# Altium schematic sheet SCH_Persion_Counter.SchDoc
size A3; SheetNumber: 1; SheetTotal: 1
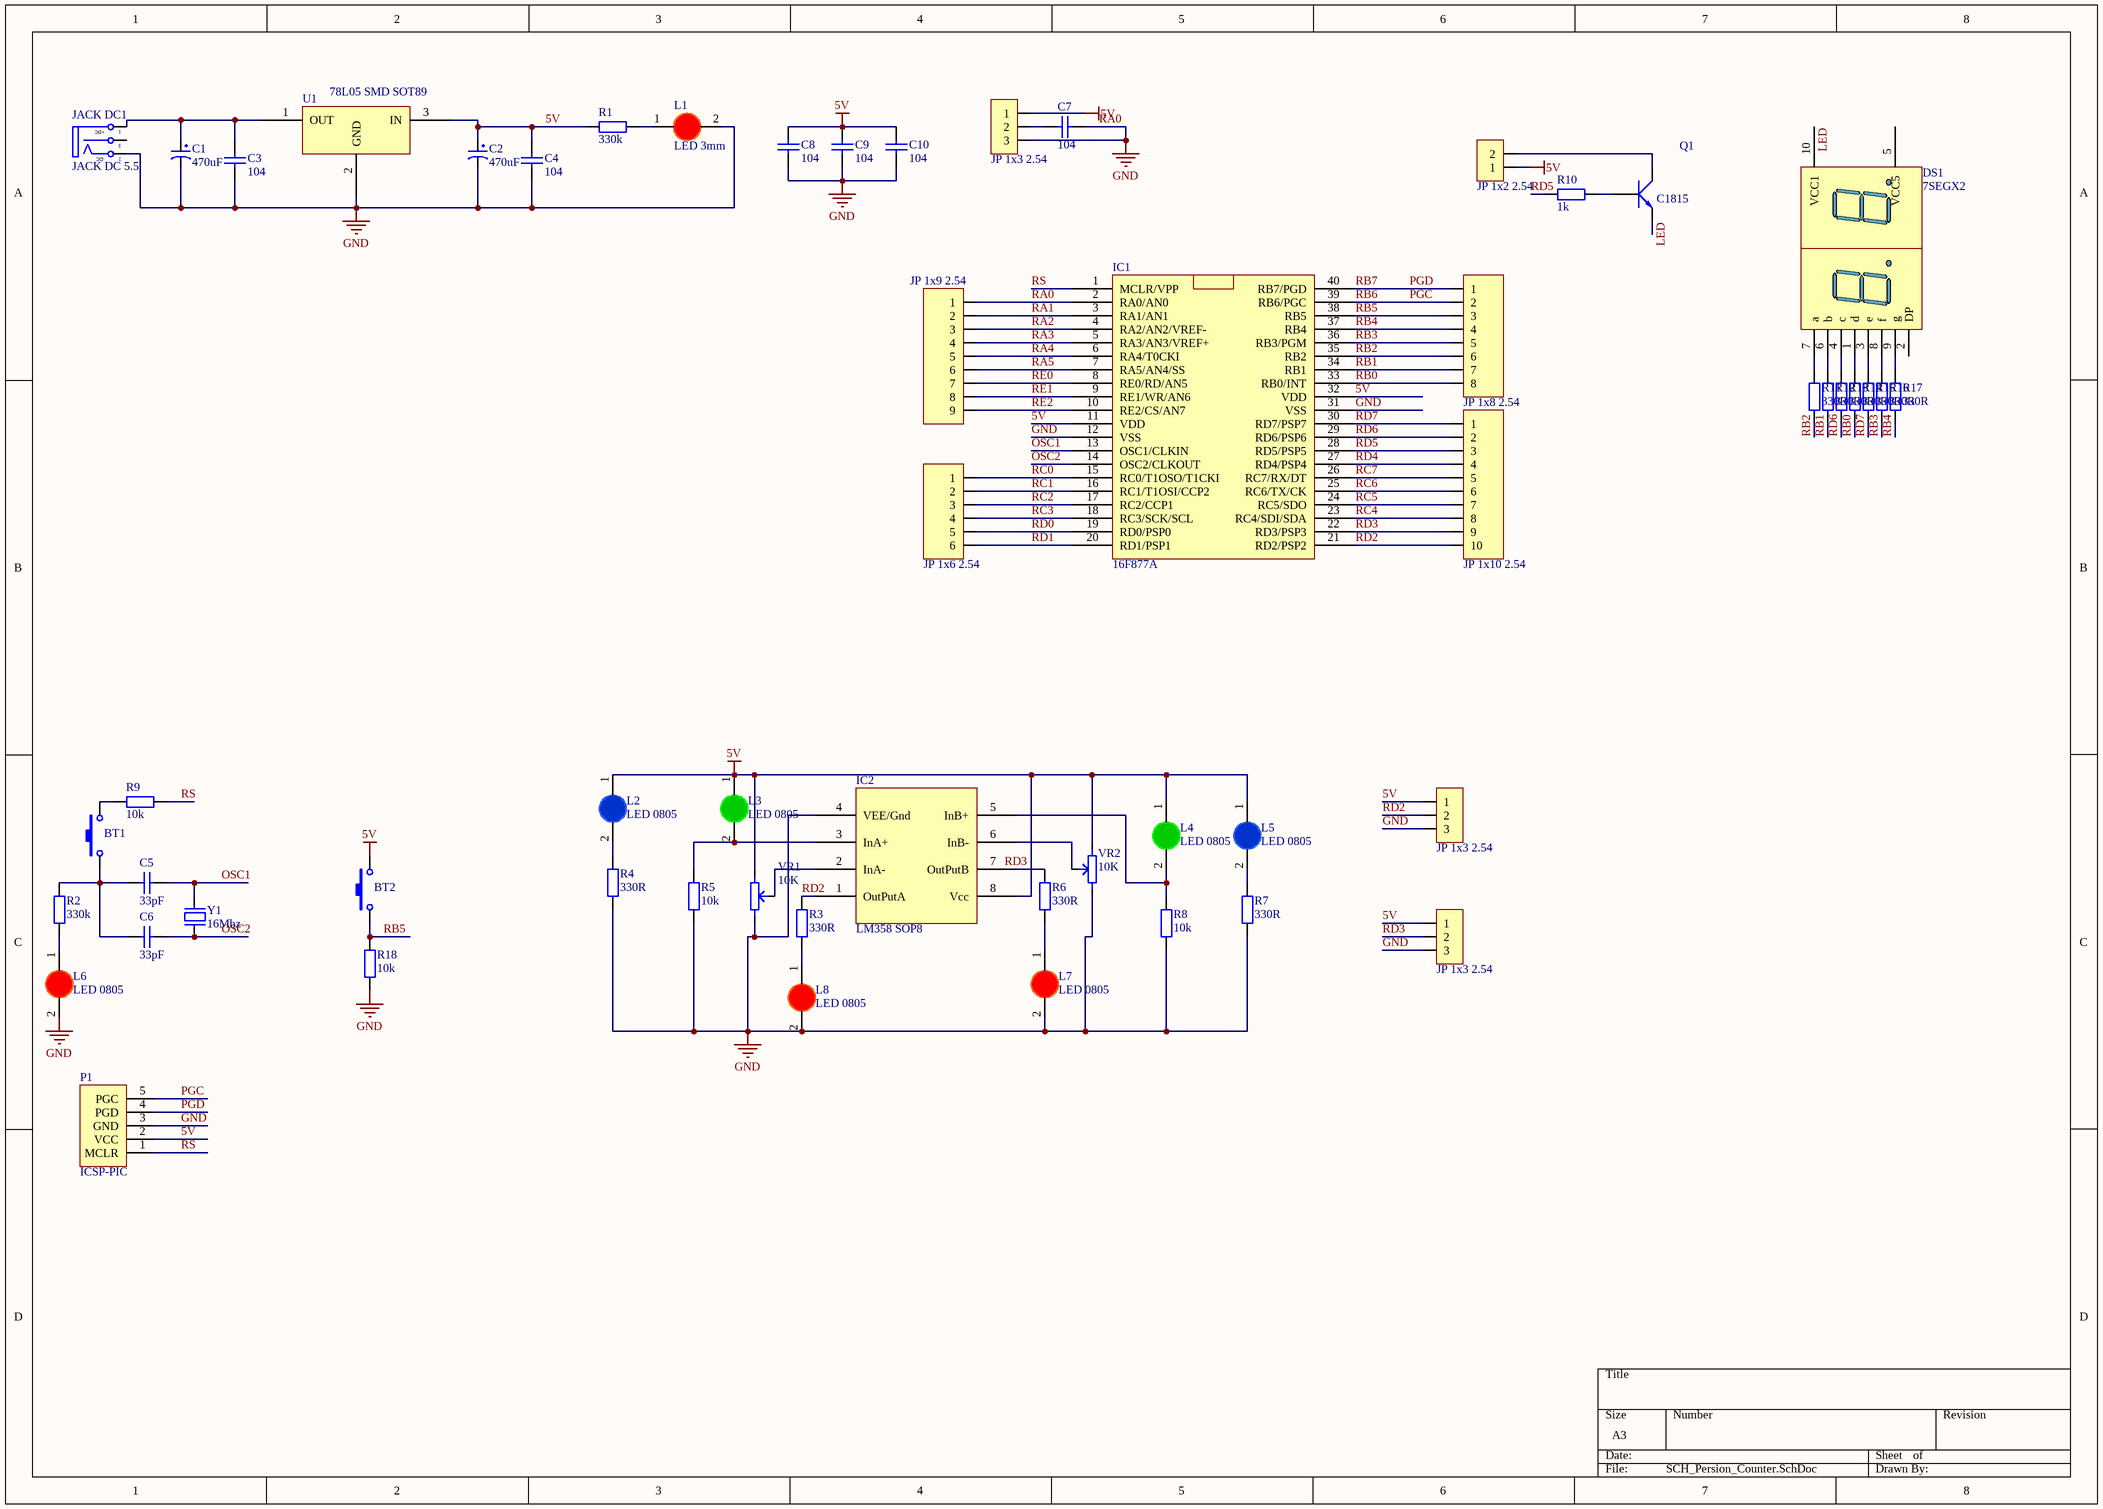
[diagram p0: SCH_Persion_Counter.SchDoc]

## Parts
BT1  Nut Nhan 2 Chan SMD 3x6x2.5  [Nut Nhan 2 Chan SMD 3x6x2.5]  (value not drawn)
BT2  Nut Nhan 2 Chan SMD 3x6x2.5  [Nut Nhan 2 Chan SMD 3x6x2.5]  (value not drawn)
C1  470uF  [tu hoa 8mm]
C2  470uF  [tu hoa 8mm]
C3  104  [tu 0805]
C4  104  [tu 0805]
C5  33pF  [tu 0805]
C6  33pF  [tu 0805]
C7  104  [tu 0805]
C8  104  [tu 0805]
C9  104  [tu 0805]
C10  104  [tu 0805]
DS1  7SEGX2  [LED7SEGX2]
IC1  16F877A  [DIP40/W0.6]
IC2  LM358 SOP8  [SOP 8]
JACK_DC1  JACK DC 5.5  [JACK DC 5.5]
JP1  JP 1x3 2.54  [JP 1x3 DT]
JP2  JP 1x8 2.54  [JP 1x8 DT]
JP3  JP 1x9 2.54  [JP 1x9 DT]
JP4  JP 1x10 2.54  [JP 1x10 DT]
JP5  JP 1x6 2.54  [JP 1x6 DT]
JP6  JP 1x3 2.54  [JP 1x3 DT]
JP7  JP 1x3 2.54  [JP 1x3 DT]
JP8  JP 1x2 2.54  [JP 1x2 DT]
L1  LED 3mm  [LED-3MM-RED]
L2  LED 0805  [LED-0805-Blue]
L3  LED 0805  [LED-0805-Green]
L4  LED 0805  [LED-0805-Green]
L5  LED 0805  [LED-0805-Blue]
L6  LED 0805  [LED-0805-Red]
L7  LED 0805  [LED-0805-Red]
L8  LED 0805  [LED-0805-Red]
P1  ICSP-PIC  [HDR1X5]
Q1  C1815  [TO92]
R1  330k  [tro vach 1/4w]
R2  330k  [tro vach 1/4w]
R3  330R  [Tro SMD 0805]
R4  330R  [Tro SMD 0805]
R5  10k  [tro vach 1/4w]
R6  330R  [Tro SMD 0805]
R7  330R  [Tro SMD 0805]
R8  10k  [tro vach 1/4w]
R9  10k  [tro vach 1/4w]
R10  1k  [tro smd 0805]
R11  330R  [Tro SMD 0805]
R12  330R  [Tro SMD 0805]
R13  330R  [Tro SMD 0805]
R14  330R  [Tro SMD 0805]
R15  330R  [Tro SMD 0805]
R16  330R  [Tro SMD 0805]
R17  330R  [Tro SMD 0805]
R18  10k  [tro vach 1/4w]
U1  78L05 SMD SOT89  [SOT89]
VR1  10K  [Bien Tro Tam Giac Dung]
VR2  10K  [Bien Tro Tam Giac Dung]
Y1  16Mhz  [Thach Anh 2 chan SMD]

## Nets
5V: BT2.2 C2.1 C4.1 C8.1 C9.1 C10.1 IC1.11(VDD) IC1.32(VDD) IC2.8(Vcc) JP1.1 JP6.1 JP7.1 JP8.1 L2.1(A) L3.1(A) L4.1(A) L5.1(A) P1.2(VCC) R1.2 U1.3(IN) VR1.1 VR2.1
GND: C1.2 C2.2 C3.2 C4.2 C7.1 C8.2 C9.2 C10.2 IC1.12(VSS) IC1.31(VSS) IC2.4(VEE/Gnd) JACK_DC1.2(TN) JP1.3 JP6.3 JP7.3 L1.2(K) L6.2(K) L7.2(K) L8.2(K) P1.3(GND) R4.2 R5.1 R7.2 R8.1 R18.1 U1.2(GND) VR1.3 VR2.3  [also labelled RA0]
LED: DS1.10(VCC1) Q1.1(E)
OSC1: C5.1 IC1.13(OSC1/CLKIN) Y1.2
OSC2: C6.2 IC1.14(OSC2/CLKOUT) Y1.1
PGC: IC1.39(RB6/PGC) JP2.2 P1.5(PGC)  [also labelled RB6]
PGD: IC1.40(RB7/PGD) JP2.1 P1.4(PGD)  [also labelled RB7]
RA~{0}: IC1.2(RA0/AN0) JP3.1
RA1: IC1.3(RA1/AN1) JP3.2
RA2: IC1.4(RA2/AN2/VREF-) JP3.3
RA3: IC1.5(RA3/AN3/VREF+) JP3.4
RA4: IC1.6(RA4/T0CKI) JP3.5
RA5: IC1.7(RA5/AN4/SS) JP3.6
RB0: IC1.33(RB0/INT) JP2.8 R14.1
RB1: IC1.34(RB1) JP2.7 R12.1
RB2: IC1.35(RB2) JP2.6 R11.1
RB3: IC1.36(RB3/PGM) JP2.5 R16.1
RB4: IC1.37(RB4) JP2.4 R17.1
RB5: BT2.1 IC1.38(RB5) JP2.3 R18.2
RC0: IC1.15(RC0/T1OSO/T1CKI) JP5.1
RC1: IC1.16(RC1/T1OSI/CCP2) JP5.2
RC2: IC1.17(RC2/CCP1) JP5.3
RC3: IC1.18(RC3/SCK/SCL) JP5.4
RC4: IC1.23(RC4/SDI/SDA) JP4.8
RC5: IC1.24(RC5/SDO) JP4.7
RC6: IC1.25(RC6/TX/CK) JP4.6
RC7: IC1.26(RC7/RX/DT) JP4.5
RD0: IC1.19(RD0/PSP0) JP5.5
RD1: IC1.20(RD1/PSP1) JP5.6
RD2: IC1.21(RD2/PSP2) IC2.1(OutPutA) JP4.10 JP6.2 R3.1
RD3: IC1.22(RD3/PSP3) JP4.9 JP7.2
RD4: IC1.27(RD4/PSP4) JP4.4
RD5: IC1.28(RD5/PSP5) JP4.3 R10.1
RD6: IC1.29(RD6/PSP6) JP4.2 R13.1
RD7: IC1.30(RD7/PSP7) JP4.1 R15.1
RE0: IC1.8(RE0/RD/AN5) JP3.7
RE1: IC1.9(RE1/WR/AN6) JP3.8
RE2: IC1.10(RE2/CS/AN7) JP3.9
RS: IC1.1(MCLR/VPP) P1.1(MCLR) R9.2
NetBT1_1: BT1.1 C5.2 C6.1 R2.2
NetBT1_2: BT1.2 R9.1
NetC1_1: C1.1 C3.1 JACK_DC1.1(T) U1.1(OUT)
NetC7_2: C7.2 JP1.2
NetDS1_1: DS1.1(d) R14.2
NetDS1_3: DS1.3(e) R15.2
NetDS1_4: DS1.4(c) R13.2
NetDS1_6: DS1.6(b) R12.2
NetDS1_7: DS1.7(a) R11.2
NetDS1_8: DS1.8(f) R16.2
NetDS1_9: DS1.9(g) R17.2
NetIC2_2: IC2.2(InA-) VR1.2
NetIC2_3: IC2.3(InA+) L3.2(K) R5.2
NetIC2_5: IC2.5(InB+) L4.2(K) R8.2
NetIC2_6: IC2.6(InB-) VR2.2
NetIC2_7: IC2.7(OutPutB) R6.1
NetJP8_2: JP8.2 Q1.2(C)
NetL1_1: L1.1(A) R1.1
NetL2_2: L2.2(K) R4.1
NetL5_2: L5.2(K) R7.1
NetL6_1: L6.1(A) R2.1
NetL7_1: L7.1(A) R6.2
NetL8_1: L8.1(A) R3.2
NetQ1_3: Q1.3(B) R10.2

Not connected (* = marked no-connect by the designer): DS1 2(DP) 5(VCC5); JACK_DC1 3(S)

## Notes on the sheet
- Labels drawn without touching a wire or pin: RD3
- (in symbol JACK DC 5.5) +DC; -DC

## Library data of the parts
BT1 BT2 = Nut Nhan 2 Chan SMD 3x6x2.5: Ma_Hang: MH001036; Ten: Nút Nhấn 2 Chân 3x6x2.5MM SMD
C1 C2 = Tu Hoa 470uF 16V 8x11: Cắm; Don_Vi: Con; So_Chan: 2; Ten_Linh_Kien: Tụ Hóa 470uF 16V 8x11MM; Ma_Hang: MH006550; Chung_Loai: Cắm; Kieu_Chan: *
C3 C4 C7-C10 = Tu 0805 104 50V 10%: Dán; Don_Vi: Con; So_Chan: 2; Ten_Linh_Kien: Tụ 0805 104-100nF 10% 50V; Ma_Hang: MH004551; Chung_Loai: Dán; Kieu_Chan: *
C5 C6 = Tu 0805 33pF 50V 10%: Dán; Don_Vi: Con; So_Chan: 2; Ten_Linh_Kien: Tụ 0805 33p 10% 50V; Ma_Hang: MH004563; Chung_Loai: Dán; Kieu_Chan: *
DS1 = LED 7SEGX2: 14.2 mm General Purpose Blue 7-Segment Display: CA, RH DP, Gray Surface; MinimumIntensity: 2020 ucd; Note: IF = 10 mA; Published: 8-Jun-2000; LatestRevisionDate: 17-Dec-2003; LatestRevisionNote: Schematic revised, PCB Footprint replaced.; DatasheetDocument: 24-Sep-2002; PackageDocument: 24-Sep-2002; PackageReference: H; Publisher: Altium Limited; Colour: Blue; ComponentLink1Description: Manufacturer Link; ComponentLink1URL: http://www.agilent.com/
IC1 = PIC 16F877A
IC2 = LM358 SOP8: Dán; Ma_Hang: MH000609; Don_Vi: Con; Ten_Linh_Kien: LM358 SOP8; Kieu_Chan: *; Ghi_Chu: *; Chung_Loai: Dán
JACK_DC1 = JACK DC 5.5: Value: Jac DC
JP1 JP6 JP7 = JP 1x3 2.54 Duc Thang: Cắm; Ten_Linh_Kien: Jump Đơn Đực 2.54MM 1x40P Thẳng 11MM; Don_Vi: Con; Ma_Hang: MH000903; Ghi_Chu: *; Kieu_Chan: *; Chung_Loai: Cắm
JP2 = JP 1x8 2.54 Duc Thang: Cắm; Ten_Linh_Kien: Jump Đơn Đực 2.54MM 1x40P Thẳng 11MM; Don_Vi: Con; Ma_Hang: MH000903; Ghi_Chu: *; Kieu_Chan: *; Chung_Loai: Cắm
JP3 = JP 1x9 2.54 Duc Thang: Cắm; Ten_Linh_Kien: Jump Đơn Đực 2.54MM 1x40P Thẳng 11MM; Don_Vi: Con; Ma_Hang: MH000903; Ghi_Chu: *; Kieu_Chan: *; Chung_Loai: Cắm
JP4 = JP 1x10 2.54 Duc Thang: Cắm; Ten_Linh_Kien: Jump Đơn Đực 2.54MM 1x40P Thẳng 11MM; Don_Vi: Con; Ma_Hang: MH000903; Ghi_Chu: *; Kieu_Chan: *; Chung_Loai: Cắm
JP5 = JP 1x6 2.54 Duc Thang: Cắm; Ten_Linh_Kien: Jump Đơn Đực 2.54MM 1x40P Thẳng 11MM; Don_Vi: Con; Ma_Hang: MH000903; Ghi_Chu: *; Kieu_Chan: *; Chung_Loai: Cắm
JP8 = JP 1x2 2.54 Duc Thang: Cắm; Ten_Linh_Kien: Jump Đơn Đực 2.54MM 1x40P Thẳng 11MM; Don_Vi: Con; Ma_Hang: MH000903; Ghi_Chu: *; Kieu_Chan: *; Chung_Loai: Cắm
L1 = LED 3mm Do: Cắm; Don_Vi: Con; Ma_Hang: MH003892; Ten_Linh_Kien: Led 3MM Phủ Đỏ (10c); Ghi_Chu: *; Kieu_Chan: *; Chung_Loai: Cắm
L2 L5 = LED 0805 Xanh Duong: Dán; Don_Vi: Con; Ma_Hang: MH002327; Ten_Linh_Kien: LED 0805 Màu Xanh Dương (Blue); Ghi_Chu: *; Kieu_Chan: *; Chung_Loai: Dán
L3 L4 = LED 0805 Xanh La: Dán; Don_Vi: Con; Ma_Hang: MH002326; Ten_Linh_Kien: LED 0805 Màu Xanh Lá (Green); Ghi_Chu: *; Kieu_Chan: *; Chung_Loai: Dán
L6-L8 = LED 0805 Do: Dán; Don_Vi: Con; Ma_Hang: MH000897; Ten_Linh_Kien: LED 0805 Màu Đỏ (Red); Ghi_Chu: *; Kieu_Chan: *; Chung_Loai: Dán
P1 = ICSP-PIC: Header, 5-Pin; LatestRevisionDate: 17-Jul-2002; LatestRevisionNote: Re-released for DXP Platform.; Publisher: Altium Limited
Q1 = C1815: NPN transistor; Value: C9014
R1 R2 = Tro Vach 1/4W 5% 330k: Cắm; Don_Vi: Con; So_Chan: 2; Ten_Linh_Kien: Trở Vạch 1/4w 5% 330k; Ma_Hang: MH007312; Chung_Loai: Cắm; Kieu_Chan: *
R3 R4 R6 R7 R11-R17 = Tro 0805 5% 330R: Dán; Don_Vi: Con; So_Chan: 2; Ten_Linh_Kien: Trở 0805 5% 330R; Ma_Hang: MH005337; Chung_Loai: Dán; Kieu_Chan: *
R5 R8 R9 R18 = Tro Vach 1/4W 5% 10k: Căm; Chung_Loai: Cắm; Don_Vi: Con; So_Chan: 2; Ten_Linh_Kien: Trở Vạch 1/4w 5% 10K; Ma_Hang: MH007354; Kieu_Chan: *
R10 = Tro 0805 1% 1k: Dán; Don_Vi: Con; So_Chan: 2; Ten_Linh_Kien: Trở 0805 1% 1k; Ma_Hang: MH005468; Chung_Loai: Dán; Kieu_Chan: *
U1 = 78L05 SMD SOT89: Dán; Ten_Linh_Kien: 78L05 SOT89 0.1A 5V; Don_Vi: Con; Ma_Hang: MH004845; Ghi_Chu: *; Kieu_Chan: *; Chung_Loai: Dán
VR1 VR2 = Bien tro tam giac 10K Dung: Cắm; Ma_Hang: MH000919; Don_Vi: Con; Ten_Linh_Kien: Biến Trở Tam Giác 103-10K RM065 (Chân Đứng); Chung_Loai: Cắm; Kieu_Chan: *
Y1 = Thach Anh 2 chan SMD: Crystal For all Crystal 2pin.; Value: 4Mhz